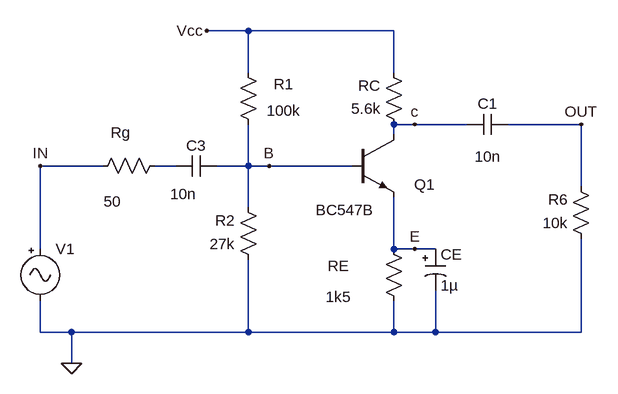
[diagram p0: schematic bs547b.asc]
bs547b.asc, the LTspice schematic file:
Version 4
SHEET 1 880 680
WIRE 256 -64 192 -64
WIRE 480 -64 256 -64
WIRE 256 0 256 -64
WIRE 480 0 480 -64
WIRE 512 80 480 80
WIRE 592 80 512 80
WIRE 768 80 656 80
WIRE 480 96 480 80
WIRE 32 144 -64 144
WIRE 144 144 112 144
WIRE 256 144 256 80
WIRE 256 144 208 144
WIRE 288 144 256 144
WIRE 416 144 288 144
WIRE 768 176 768 80
WIRE 256 208 256 144
WIRE -64 272 -64 144
WIRE 480 272 480 192
WIRE 512 272 480 272
WIRE 544 272 512 272
WIRE -64 400 -64 352
WIRE -16 400 -64 400
WIRE 256 400 256 288
WIRE 256 400 -16 400
WIRE 480 400 480 352
WIRE 480 400 256 400
WIRE 544 400 544 336
WIRE 544 400 480 400
WIRE 768 400 768 256
WIRE 768 400 544 400
WIRE -16 448 -16 400
FLAG -16 448 0
FLAG 768 80 OUT
FLAG -64 144 IN
FLAG 288 144 B
FLAG 512 272 E
FLAG 512 80 c
FLAG 192 -64 Vcc
SYMBOL res 128 128 R90
WINDOW 0 -20 68 VBottom 2
WINDOW 3 55 81 VTop 2
SYMATTR InstName Rg
SYMATTR Value 50
SYMBOL res 272 96 R180
WINDOW 0 -54 78 Left 2
WINDOW 3 -65 37 Left 2
SYMATTR InstName R1
SYMATTR Value 100k
SYMBOL res 272 304 R180
WINDOW 0 36 76 Left 2
WINDOW 3 36 40 Left 2
SYMATTR InstName R2
SYMATTR Value 27k
SYMBOL res 496 368 R180
WINDOW 0 85 70 Left 2
WINDOW 3 82 22 Left 2
SYMATTR InstName RE
SYMATTR Value 1k5
SYMBOL res 496 96 R180
WINDOW 0 36 76 Left 2
WINDOW 3 36 40 Left 2
SYMATTR InstName RC
SYMATTR Value 5.6k
SYMBOL res 784 272 R180
WINDOW 0 36 76 Left 2
WINDOW 3 36 40 Left 2
SYMATTR InstName R6
SYMATTR Value 10k
SYMBOL cap 656 64 R90
WINDOW 0 0 32 VBottom 2
WINDOW 3 50 31 VTop 2
SYMATTR InstName C1
SYMATTR Value 10n
SYMBOL cap 144 160 R270
WINDOW 0 32 32 VTop 2
WINDOW 3 -12 12 VBottom 2
SYMATTR InstName C3
SYMATTR Value 10n
SYMBOL npn 416 96 R0
WINDOW 0 95 77 Left 2
WINDOW 3 -56 116 Left 2
SYMATTR InstName Q1
SYMATTR Value BC547B
SYMBOL polcap 528 272 R0
SYMATTR InstName CE
SYMATTR Value 1µ
SYMBOL Misc\\signal -64 256 R0
WINDOW 123 24 132 Left 2
WINDOW 39 0 0 Left 0
SYMATTR InstName V1
SYMATTR Value ""

The netlist it stands for:
* bs547b.asc
Rg N001 IN 50
R1 B Vcc 100k
R2 0 B 27k
RE 0 E 1k5
RC c Vcc 5.6k
R6 0 OUT 10k
C1 OUT c 10n
C3 N001 B 10n
Q1 c B E 0 BC547B
CE E 0 1µ
V1 IN 0
.model NPN NPN
.model PNP PNP
.lib standard.bjt
.backanno
.end